# EAGLE design XstractiK_Domination_Player_Connector_V1 (EAGLE 9.7.0)
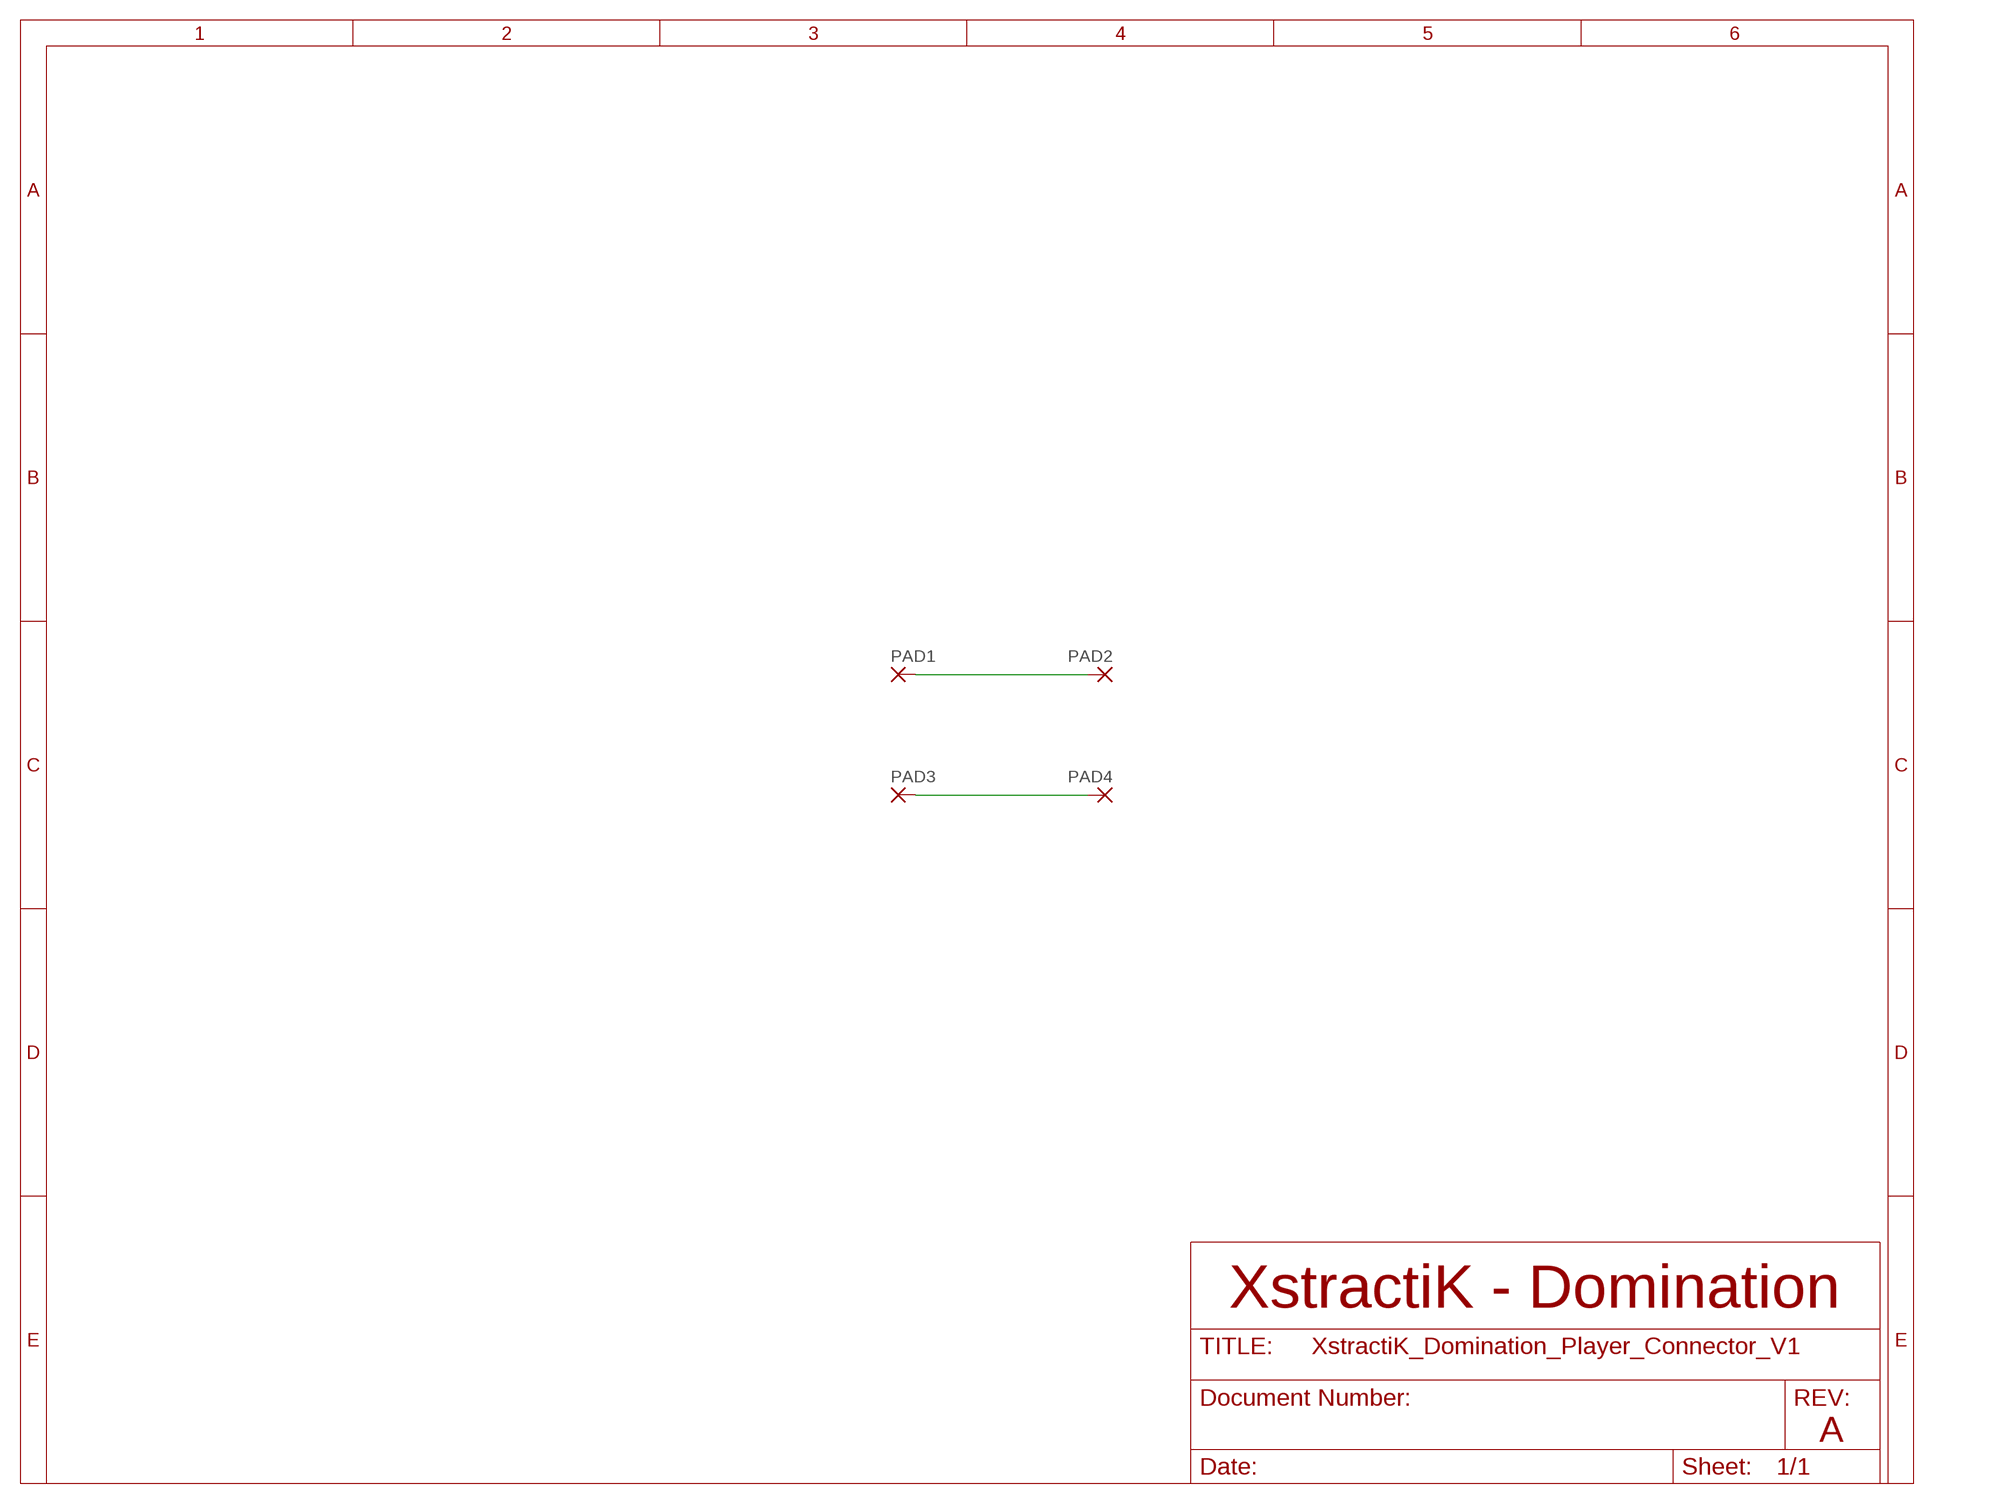
[diagram p0: schematic, sheet 1]

## Parts
PAD1  WIREPADSMD1,27-254  [SMD1,27-2,54]
PAD2  WIREPADSMD1,27-254  [SMD1,27-2,54]
PAD3  WIREPADSMD1,27-254  [SMD1,27-2,54]
PAD4  WIREPADSMD1,27-254  [SMD1,27-2,54]

## Nets
N$1: PAD1.1(P) PAD2.1(P)
N$2: PAD3.1(P) PAD4.1(P)

## Notes on the sheet
- XstractiK - Domination
- A

## Library data of the parts
PAD1-PAD4 = wirepad:WIREPAD: Wire PAD connect wire on PCB

## Board
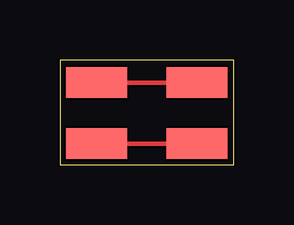
[diagram p1: board, top side]

Size 7.26 x 4.37 mm. Coordinates in mm from the lower left corner, seen from the top.
Outline: 0,0 7.26,0 7.26,4.37 0,4.37 0,0
Copper layers (1*16): Top 0.035559375mm / dielectric 1.6mm / Bottom 0.035559375mm
Design rules "jlcpcb2layer *": minimum track width 7mil, minimum drill 12mil, track to track 5mil, track to pad 5mil, pad to pad 5mil, via to via 5mil, smd to smd 5mil, copper to edge 8mil, drill to drill 6mil, minimum pad ring 5mil, minimum via ring 3mil, stop-mask expansion 2.5mil, vias tented up to drill 0mil, thermal gap 10mil

### Footprints (pad centres in the part's own frame; a part is rotated, then mirrored left to right if it is on the bottom)
SMD1,27-2,54 = smd 1.27 x 2.54: 1 0,0

### Placement (x,y rotation side)
PAD1  1.52,3.43 270 top
PAD2  5.73,3.44 270 top
PAD3  1.52,0.89 270 top
PAD4  5.73,0.9 270 top

### Tracks (layer width: path | path; a pad name or v marks a point on that pad's centre or on a via)
N$1
  Top 0.178: PAD1.1 5.72,3.43 PAD2.1
N$2
  Top 0.178: PAD3.1 5.72,0.89 PAD4.1